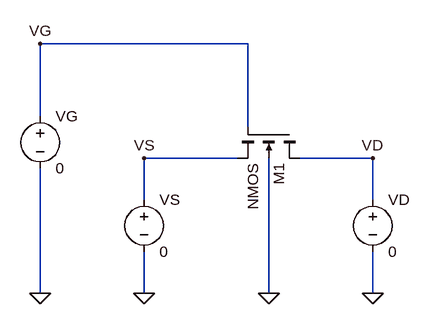
[diagram p0: schematic Chapter03A_01.fig.asc]
Chapter03A_01.fig.asc, the LTspice schematic file:
Version 4
SHEET 1 2940 740
WIRE 384 112 64 112
WIRE 64 224 64 112
WIRE 384 240 384 112
WIRE 368 288 224 288
WIRE 576 288 464 288
WIRE 224 352 224 288
WIRE 576 352 576 288
WIRE 64 496 64 304
WIRE 224 496 224 432
WIRE 416 496 416 288
WIRE 576 496 576 432
FLAG 64 496 0
FLAG 224 496 0
FLAG 576 496 0
FLAG 416 496 0
FLAG 64 112 VG
FLAG 224 288 VS
FLAG 576 288 VD
SYMBOL nmos4 464 240 R90
SYMATTR InstName M1
SYMBOL voltage 64 208 R0
WINDOW 123 0 0 Left 0
WINDOW 39 0 0 Left 0
SYMATTR InstName VG
SYMATTR Value 0
SYMBOL voltage 224 336 R0
SYMATTR InstName VS
SYMATTR Value 0
SYMBOL voltage 576 336 R0
SYMATTR InstName VD
SYMATTR Value 0

The netlist it stands for:
* Chapter03A_01.fig.asc
M1 VD VG VS 0 NMOS
VG VG 0 0
VS VS 0 0
VD VD 0 0
.model NMOS NMOS
.model PMOS PMOS
.lib standard.mos
.backanno
.end